# EAGLE design BT_atmega_v_1_2 (EAGLE 6.5.0)
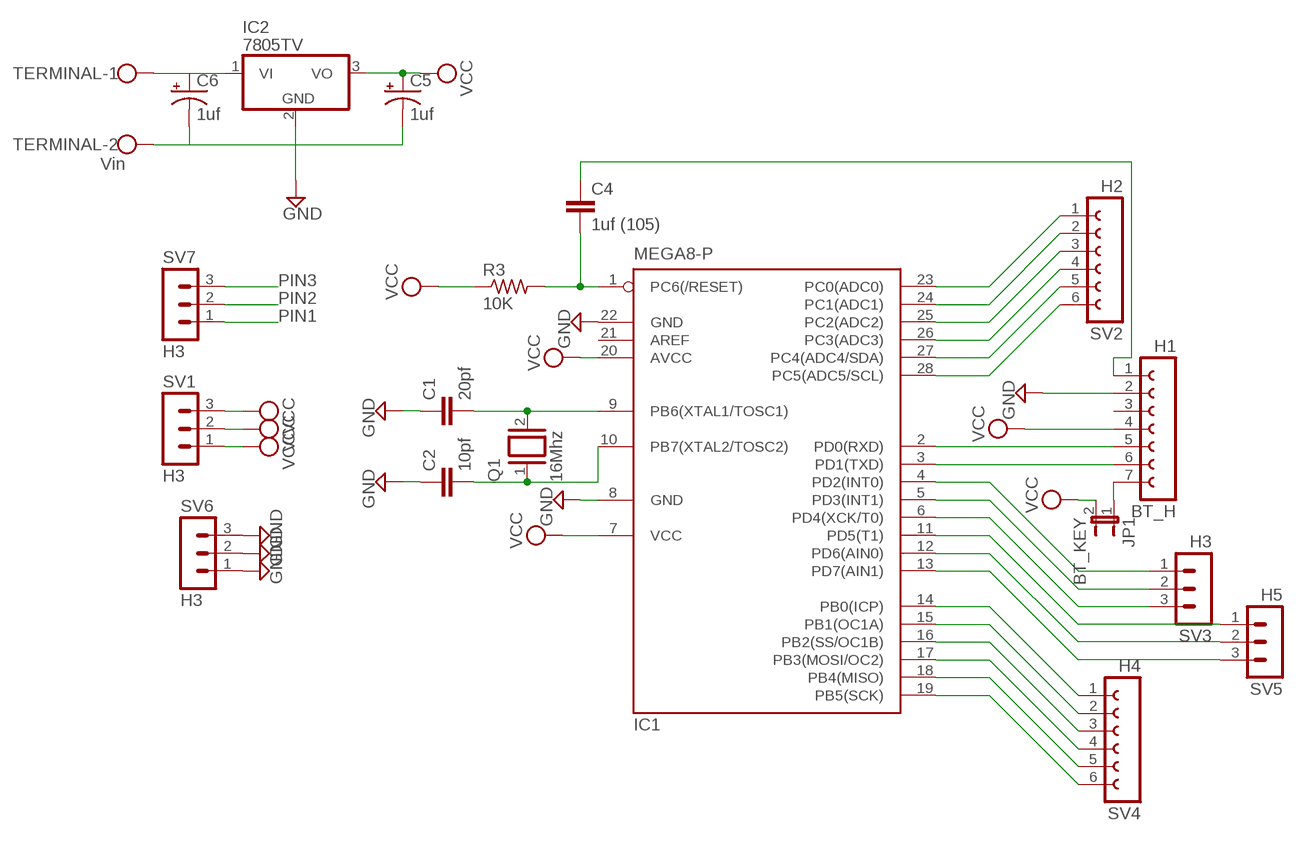
[diagram p0: schematic, sheet 1]

## Parts
BT_H  H1  FE07-1  [FE07]
C1  20pf  C2.5/2  [C2.5-2]
C2  10pf  C2.5/2  [C2.5-2]
C4  1uf (105)  C2.5/2  [C2.5-2]
C5  1uf  CPOL-USE5-4  [E5-4]
C6  1uf  CPOL-USE5-4  [E5-4]
IC1  MEGA8-P  [DIL28-3]
IC2  7805TV  [TO220V]
JP1  BT_KEY  JP1E  [JP1]
Q1  16Mhz  XTAL/S  [QS]
R3  10K  R-US_0204/5  [0204/5]
SV1  H3  MA03-1  [MA03-1]
SV2  H2  FE06-1  [FE06]
SV3  H3  MA03-1  [MA03-1]
SV4  H4  FE06-1  [FE06]
SV5  H5  MA03-1  [MA03-1]
SV6  H3  MA03-1  [MA03-1]
SV7  H3  MA03-1  [MA03-1]
TERMINAL  Vin  W237-102  [W237-102]

## Nets
GND: BT_H.2 C1.1 C2.1 C5.- C6.- IC1.8(GND) IC1.22(GND) IC2.2(GND) SV6.1 SV6.2 SV6.3 TERMINAL.2
N$1: C1.2 IC1.9(PB6(XTAL1/TOSC1)) Q1.2
N$2: C2.2 IC1.10(PB7(XTAL2/TOSC2)) Q1.1
N$7: BT_H.7 JP1.1
N$8: IC1.23(PC0(ADC0)) SV2.1
N$9: IC1.24(PC1(ADC1)) SV2.2
N$10: IC1.25(PC2(ADC2)) SV2.3
N$11: IC1.26(PC3(ADC3)) SV2.4
N$12: IC1.27(PC4(ADC4/SDA)) SV2.5
N$13: IC1.28(PC5(ADC5/SCL)) SV2.6
N$14: IC1.4(PD2(INT0)) SV3.1
N$15: IC1.5(PD3(INT1)) SV3.2
N$16: IC1.6(PD4(XCK/T0)) SV3.3
N$17: IC1.11(PD5(T1)) SV5.1
N$18: IC1.12(PD6(AIN0)) SV5.2
N$19: IC1.13(PD7(AIN1)) SV5.3
N$20: IC1.14(PB0(ICP)) SV4.1
N$21: IC1.15(PB1(OC1A)) SV4.2
N$22: IC1.16(PB2(SS/OC1B)) SV4.3
N$23: IC1.17(PB3(MOSI/OC2)) SV4.4
N$24: IC1.18(PB4(MISO)) SV4.5
N$25: IC1.19(PB5(SCK)) SV4.6
N$26: BT_H.1 C4.1
N$27: C6.+ IC2.1(VI) TERMINAL.1
PIN1: C4.2 IC1.1(PC6(/RESET)) R3.2 SV7.1
PIN2: BT_H.5 IC1.2(PD0(RXD)) SV7.2
PIN3: BT_H.6 IC1.3(PD1(TXD)) SV7.3
VCC: BT_H.4 C5.+ IC1.7(VCC) IC1.20(AVCC) IC2.3(VO) JP1.2 R3.1 SV1.1 SV1.2 SV1.3
Unconnected: BT_H.3 IC1.21(AREF)

## Library data of the parts
BT_H = con-lsta:FE07-1: FEMALE HEADER; OC_FARNELL: unknown; OC_NEWARK: unknown
C1 C2 C4 = capacitor-wima:C: CAPACITOR naming: grid - package width
C5 C6 = rcl:CPOL-US: POLARIZED CAPACITOR, American symbol
IC1 = atmel:MEGA8-P: MICROCONTROLLER 8 Kbytes FLASH, 1 kbytes SRAM, 512 bytes EEPROM, USART, 4-channel 10 bit ADC, 2-channel 8 bit ADC Pin compatible with Atmega48, ATMega88, ATMega168 Source: avr.lbr; OC_FARNELL: unknown; OC_NEWARK: unknown
IC2 = linear:78*: Positive VOLTAGE REGULATOR Source: http://cache.national.com/ds/LM/LM78L05.pdf http://www.fairchildsemi.com/ds/LM/LM7805.pdf
JP1 = jumper:JP1E: JUMPER
Q1 = special:XTAL/S: CRYSTAL
R3 = rcl:R-US_: RESISTOR, American symbol
SV1 SV3 SV5-SV7 = con-lstb:MA03-1: PIN HEADER; OC_FARNELL: unknown; OC_NEWARK: unknown
SV2 SV4 = con-lsta:FE06-1: FEMALE HEADER; OC_FARNELL: unknown; OC_NEWARK: unknown
TERMINAL = con-wago-500:W237-102: WAGO SCREW CLAMP; MPN: 237-102; OC_FARNELL: unknown; OC_NEWARK: 70K9898

## Board
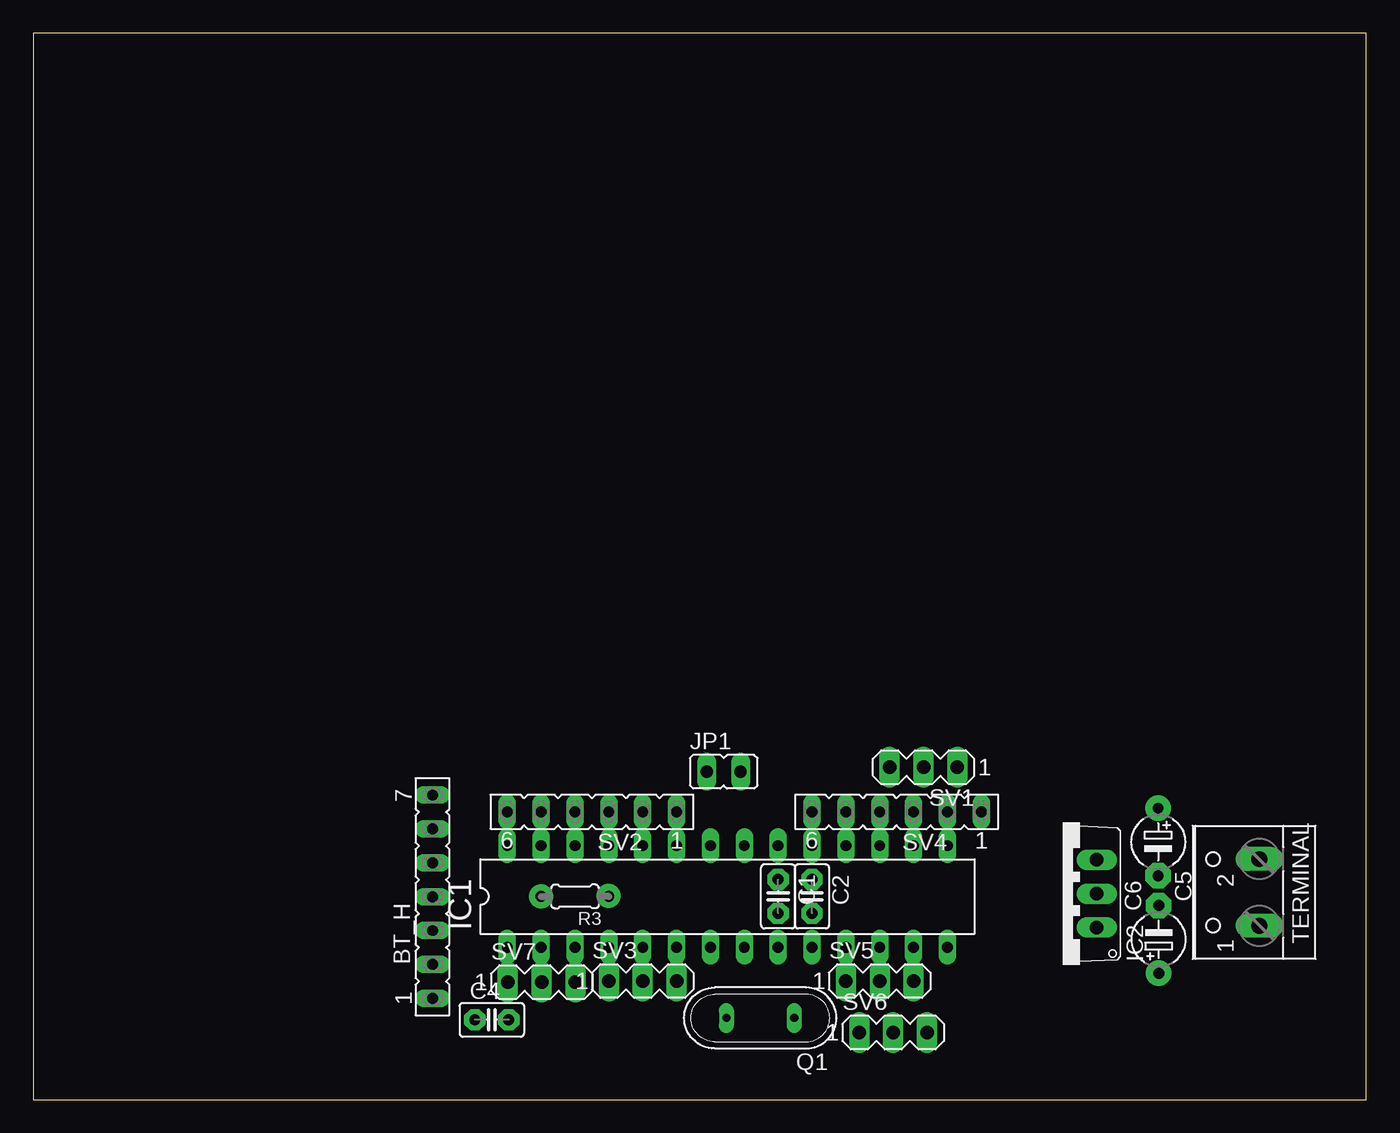
[diagram p1: board, top side]
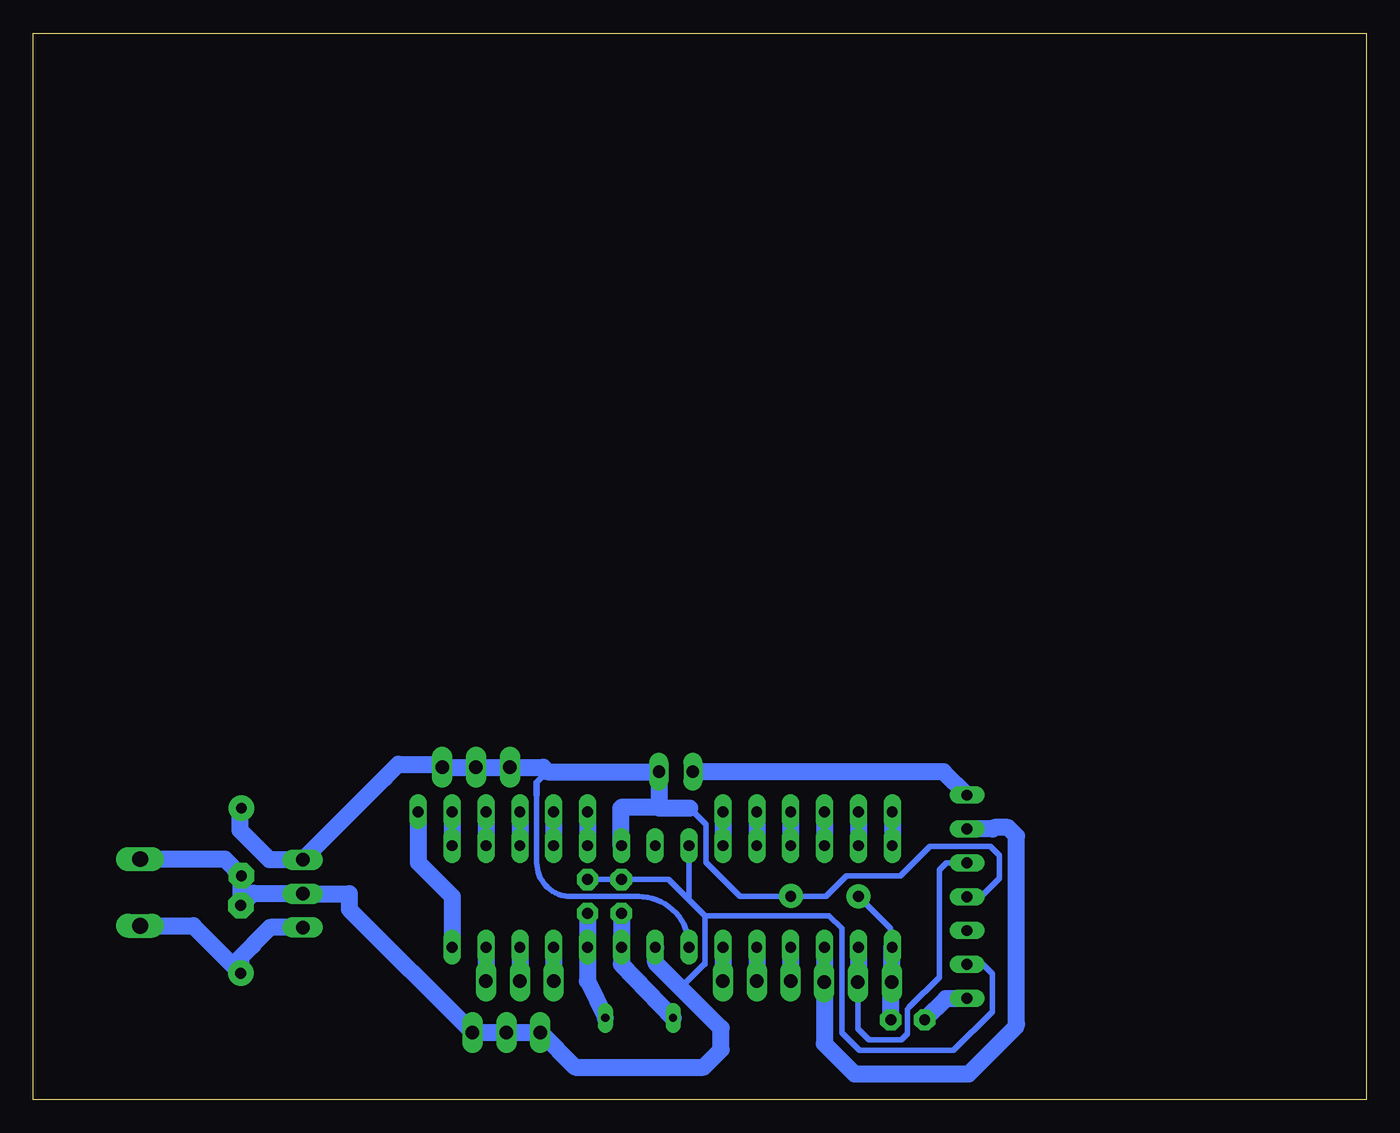
[diagram p2: board, bottom side, seen from below]

Size 100 x 80 mm. Coordinates in mm from the lower left corner, seen from the top.
Outline: 0,0 100,0 100,80 0,80 0,0
Copper layers (1*16): Top 0.035mm / dielectric 1.5mm / Bottom 0.035mm
Design rules "default": minimum track width 10mil, minimum drill 24mil, track to track 8mil, track to pad 8mil, pad to pad 8mil, via to via 8mil, smd to smd 8mil, copper to edge 40mil, drill to drill 8mil, minimum pad ring 10mil, minimum via ring 8mil, stop-mask expansion 4mil, vias tented up to drill 0mil, thermal gap 10mil

### Footprints (pad centres in the part's own frame; a part is rotated, then mirrored left to right if it is on the bottom)
FE07 = drill 0.813 long: 1 -7.62,0; 2 -5.08,0; 3 -2.54,0; 4 0,0; 5 2.54,0; 6 5.08,0; 7 7.62,0
C2.5-2 = drill 0.813 pad 1.6 octagon: 1 -1.27,0; 2 1.27,0
E5-4 = drill 0.813 pad 1.905: + -2.54,0 | drill 0.813 pad 1.905 octagon: - 2.54,0
DIL28-3 = drill 0.813 long: 1 -16.51,-3.81; 2 -13.97,-3.81; 3 -11.43,-3.81; 4 -8.89,-3.81; 5 -6.35,-3.81; 6 -3.81,-3.81; 7 -1.27,-3.81; 8 1.27,-3.81; 9 3.81,-3.81; 10 6.35,-3.81; 11 8.89,-3.81; 12 11.43,-3.81; 13 13.97,-3.81; 14 16.51,-3.81; 15 16.51,3.81; 16 13.97,3.81; 17 11.43,3.81; 18 8.89,3.81; 19 6.35,3.81; 20 3.81,3.81; 21 1.27,3.81; 22 -1.27,3.81; 23 -3.81,3.81; 24 -6.35,3.81; 25 -8.89,3.81; 26 -11.43,3.81; 27 -13.97,3.81; 28 -16.51,3.81
TO220V = drill 1.016 long: 1 -2.54,-2.54; 2 0,-2.54; 3 2.54,-2.54
JP1 = drill 0.914 long: 1 0,-1.27; 2 0,1.27
QS = drill 0.61 long: 1 -2.54,0; 2 2.54,0
0204/5 = drill 0.813 octagon: 1 -2.54,0; 2 2.54,0
MA03-1 = drill 1.016 long: 1 -2.54,0; 2 0,0; 3 2.54,0
FE06 = drill 0.813 long: 1 -6.35,0; 2 -3.81,0; 3 -1.27,0; 4 1.27,0; 5 3.81,0; 6 6.35,0
W237-102 = drill 1.194 long: 1 -2.5,-1.27; 2 2.5,-1.27

### Placement (x,y rotation side)
BT_H  29.95,15.22 90 top
C1  55.88,15.24 270 top
C2  58.42,15.24 270 top
C4  34.4,5.98 0 top
C5  84.39,19.33 270 top
C6  84.44,12.02 90 top
IC1  52.07,15.24 0 top
IC2  77.25,15.45 90 top
JP1  51.79,24.6 270 top
Q1  54.54,6.12 180 top
R3  40.64,15.24 180 top
SV1  66.79,24.93 180 top
SV2  41.91,21.59 180 top
SV3  45.72,8.89 0 top
SV4  64.77,21.59 180 top
SV5  63.5,8.89 0 top
SV6  64.51,5.03 0 top
SV7  38.14,8.8 0 top
TERMINAL  90.72,15.54 90 top

### Tracks (layer width: path | path; a pad name or v marks a point on that pad's centre or on a via)
GND
  Bottom 0.406: C2.1 C1.1 55.86,16.53 52.35,16.53 50.93,15.11 | 49.62,13.8 49.62,10.15 49.66,10.15 51.43,8.38 | 49.62,13.8 50.93,15.11 | IC1.22 50.8,15.24 50.93,15.11 | 49.62,13.8 49.61,13.79 40.3,13.79 39.35,12.84 39.35,4.99 38.04,3.68 30.97,3.68 28.05,6.59 28.05,9.45 28.81,10.21 29.88,10.21 BT_H.2
  Bottom 1.27: TERMINAL.2 85.64,18.04 C5.- 84.44,16.79 C6.- 84.42,14.56 83.5,15.48 79.83,15.48 IC2.2 76.3,15.45 76.3,14.28 SV6.3 SV6.2 SV6.1 59.35,2.42 49.72,2.42 | 49.72,2.42 48.39,3.74 48.39,5.35 51.43,8.38 53.3,10.26 53.3,11.39 IC1.8 | 49.72,2.42
N$1
  Bottom 1.27: Q1.2 55.88,10.16 IC1.9 C1.2
N$2
  Bottom 1.27: Q1.1 58.42,8.89 IC1.10 C2.2
N$7
  Bottom 1.27: BT_H.7 31.71,24.6 JP1.1
N$8
  Bottom 1.27: SV2.1 IC1.23
N$9
  Bottom 1.27: SV2.2 IC1.24
N$10
  Bottom 1.27: SV2.3 IC1.25
N$11
  Bottom 1.27: SV2.4 IC1.26
N$12
  Bottom 1.27: SV2.5 IC1.27
N$13
  Bottom 1.27: SV2.6 IC1.28
N$14
  Bottom 1.27: IC1.4 SV3.1
N$15
  Bottom 1.27: IC1.5 SV3.2
N$16
  Bottom 1.27: IC1.6 SV3.3
N$17
  Bottom 1.27: IC1.11 SV5.1
N$18
  Bottom 1.27: IC1.12 SV5.2
N$19
  Bottom 1.27: IC1.13 SV5.3
N$20
  Bottom 1.27: SV4.1 71.12,17.78 68.58,15.24 IC1.14
N$21
  Bottom 1.27: SV4.2 IC1.15
N$22
  Bottom 1.27: SV4.3 IC1.16
N$23
  Bottom 1.27: SV4.4 IC1.17
N$24
  Bottom 1.27: SV4.5 IC1.18
N$25
  Bottom 1.27: SV4.6 IC1.19
N$26
  Bottom 0.406: 29.98,7.57 BT_H.1
  Bottom 1.27: 29.98,7.57 31.54,7.57 C4.1
N$27
  Bottom 1.27: IC2.1 82.23,12.9 83.53,11.6 83.53,11.56 84.45,10.65 C6.+ 88,13.04 TERMINAL.1
N$28  (via drill 0.6 pad 1.78)
  other vias: 38.1,15.25
N$29  (via drill 0.6 pad 1.78)
  other vias: 43.15,15.27
PIN1
  Bottom 0.406: R3.2 36.83,13.98 35.71,12.86 35.71,11.58 IC1.1
  Bottom 1.27: IC1.1 35.6,11.39 SV7.1 35.67,8.73 C4.2
PIN2
  Bottom 0.406: BT_H.5 31.5,17.76 31.6,17.65 | 31.6,17.65 | 31.6,17.65 32.02,17.23 32.02,9.19 34.27,6.94 | IC1.2 | 34.27,6.94 | 34.27,6.94 34.42,6.78 34.42,4.91 34.87,4.47 37.31,4.47 38.13,5.29 SV7.2
  Bottom 1.27: IC1.2 38.1,8.84 SV7.2
PIN3
  Bottom 0.357: 29.84,20.19 BT_H.6
  Bottom 0.406: BT_H.6
  Bottom 1.27: IC1.3 40.64,8.84 40.66,8.82 | 40.66,8.82 SV7.3 | 40.66,8.82 40.66,4.19 38.38,1.91 29.82,1.91 26.32,5.42 26.32,5.56 26.23,5.65 26.23,19.76 26.86,20.4 27.91,20.4 28.02,20.3 BT_H.6
VCC
  Bottom 0.406: 62.23,22.86 62.23,17.78 arc-90 59.69,15.24 54.61,15.24 arc90 IC1.7 | 32.74,18.98 28.18,18.98 27.53,18.34 27.53,16.59 28.83,15.29 29.87,15.29 BT_H.4 | 32.74,18.98 34.95,16.78 38.98,16.78 40.52,15.24 R3.1 46.99,15.24 49.53,17.78 49.53,20.64 50.77,21.87 | 55.74,19.19 IC1.20 55.88,21.9 55.85,21.87 | 32.72,19.01 32.74,18.98 | JP1.2 53.14,24.52
  Bottom 0.47: 61.43,24.6 62.23,23.79 62.23,22.86
  Bottom 1.27: C5.+ 84.49,21.77 84.49,20.2 82.27,17.98 IC2.3 73.64,24.13 73.63,24.13 72.62,25.15 69.55,25.15 SV1.1 SV1.2 SV1.3 61.76,24.93 61.43,24.6 JP1.2 | 53.14,24.52 53.05,24.43 53.05,21.95 | 53.05,21.95 53.05,21.87 | 55.88,21.9 55.83,21.95 53.05,21.95 | 53.05,21.95 52.97,21.87 50.77,21.87 | IC1.20 55.92,19.09 55.92,21.86